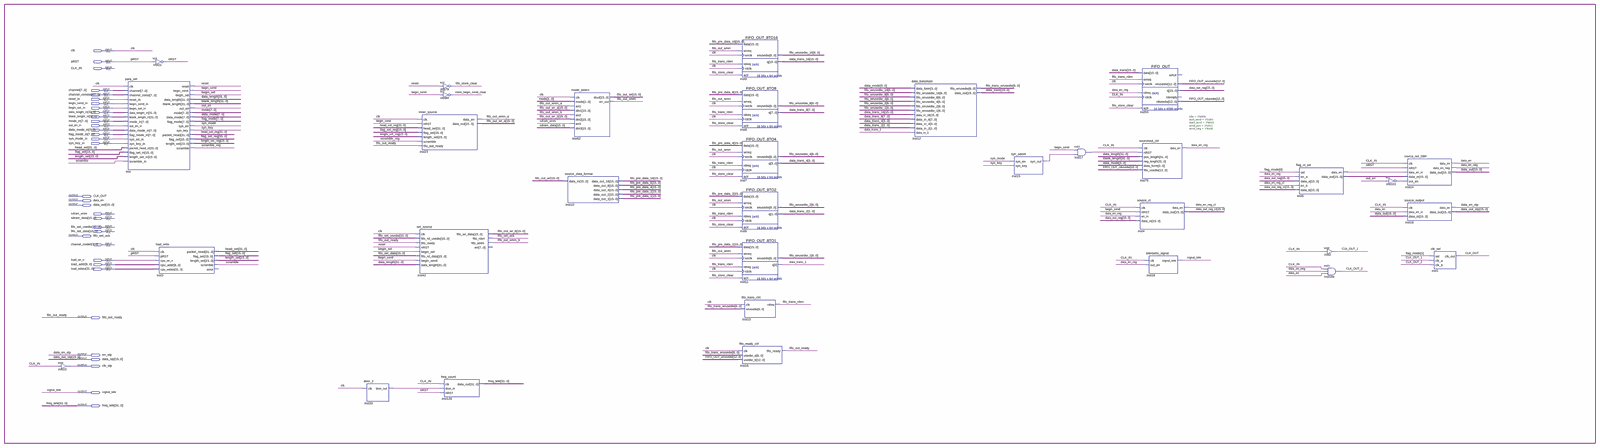
[diagram p0: schematic sheet, whole]
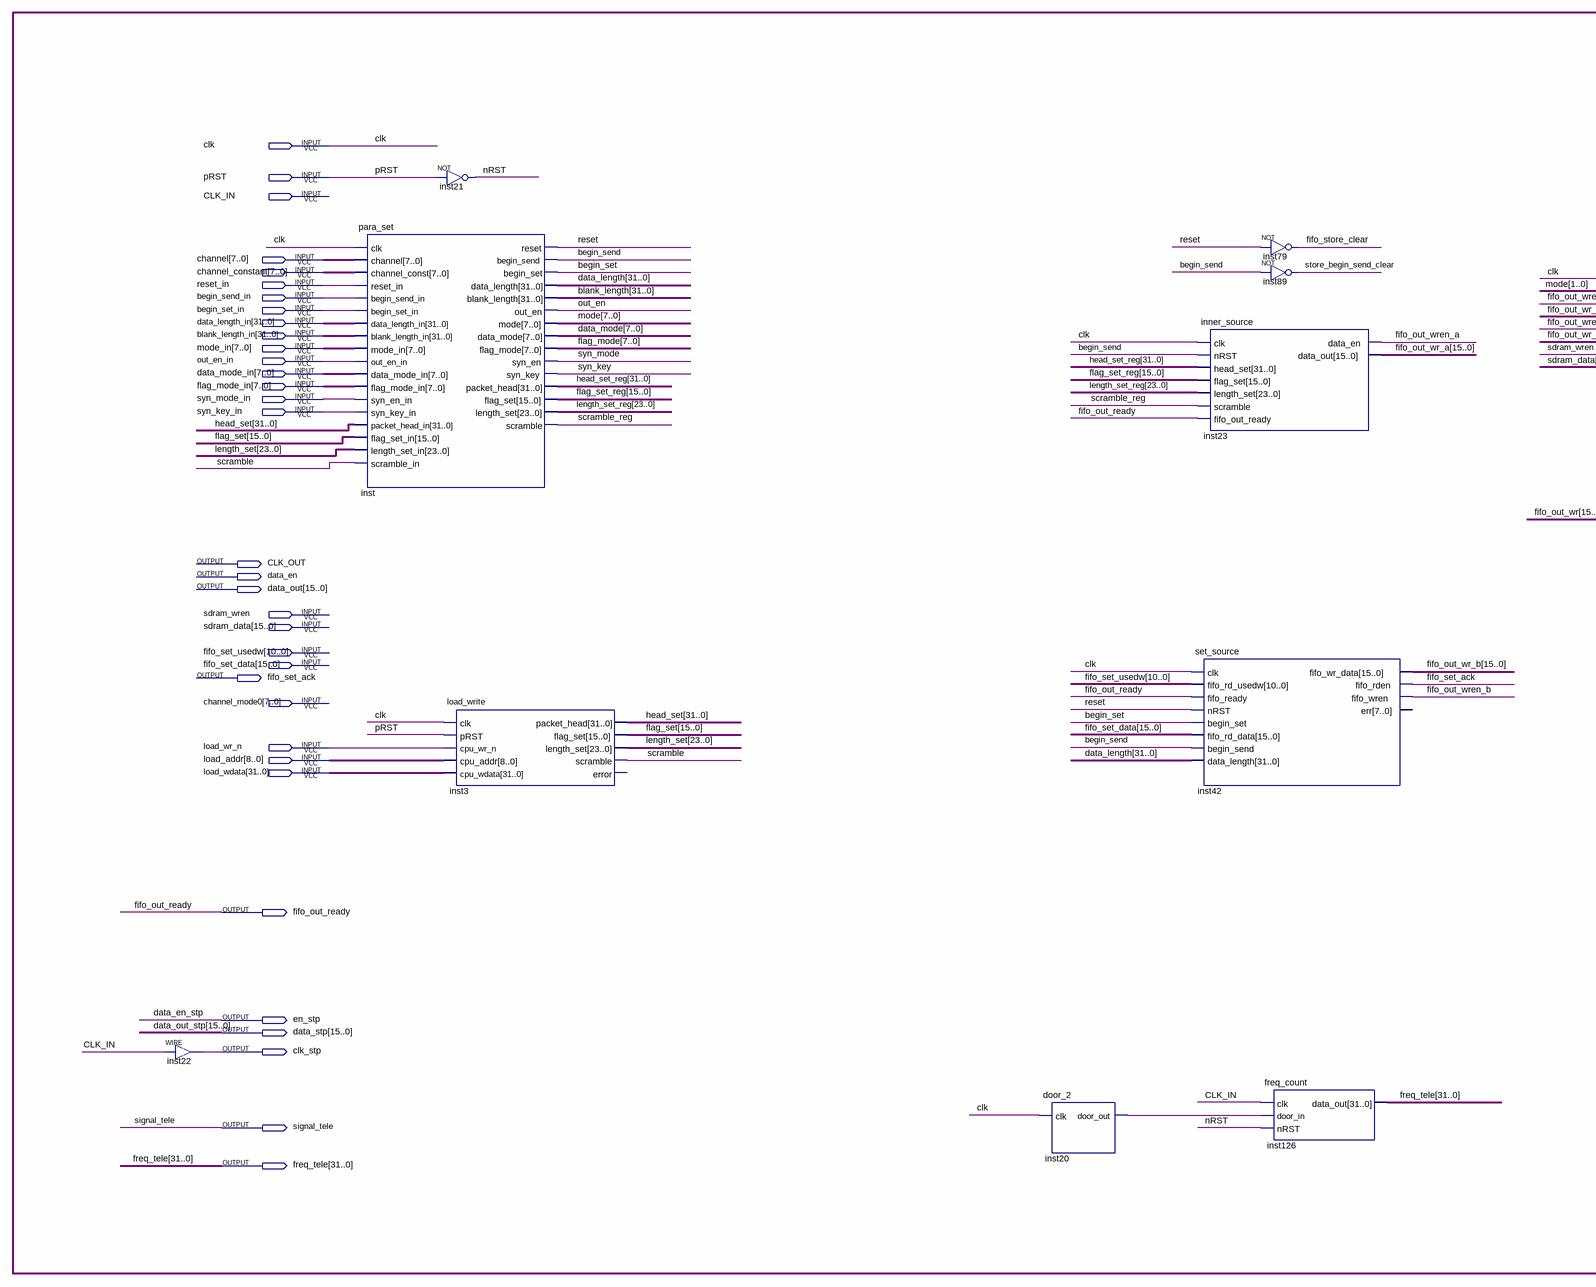
[diagram p1: schematic sheet, left part]
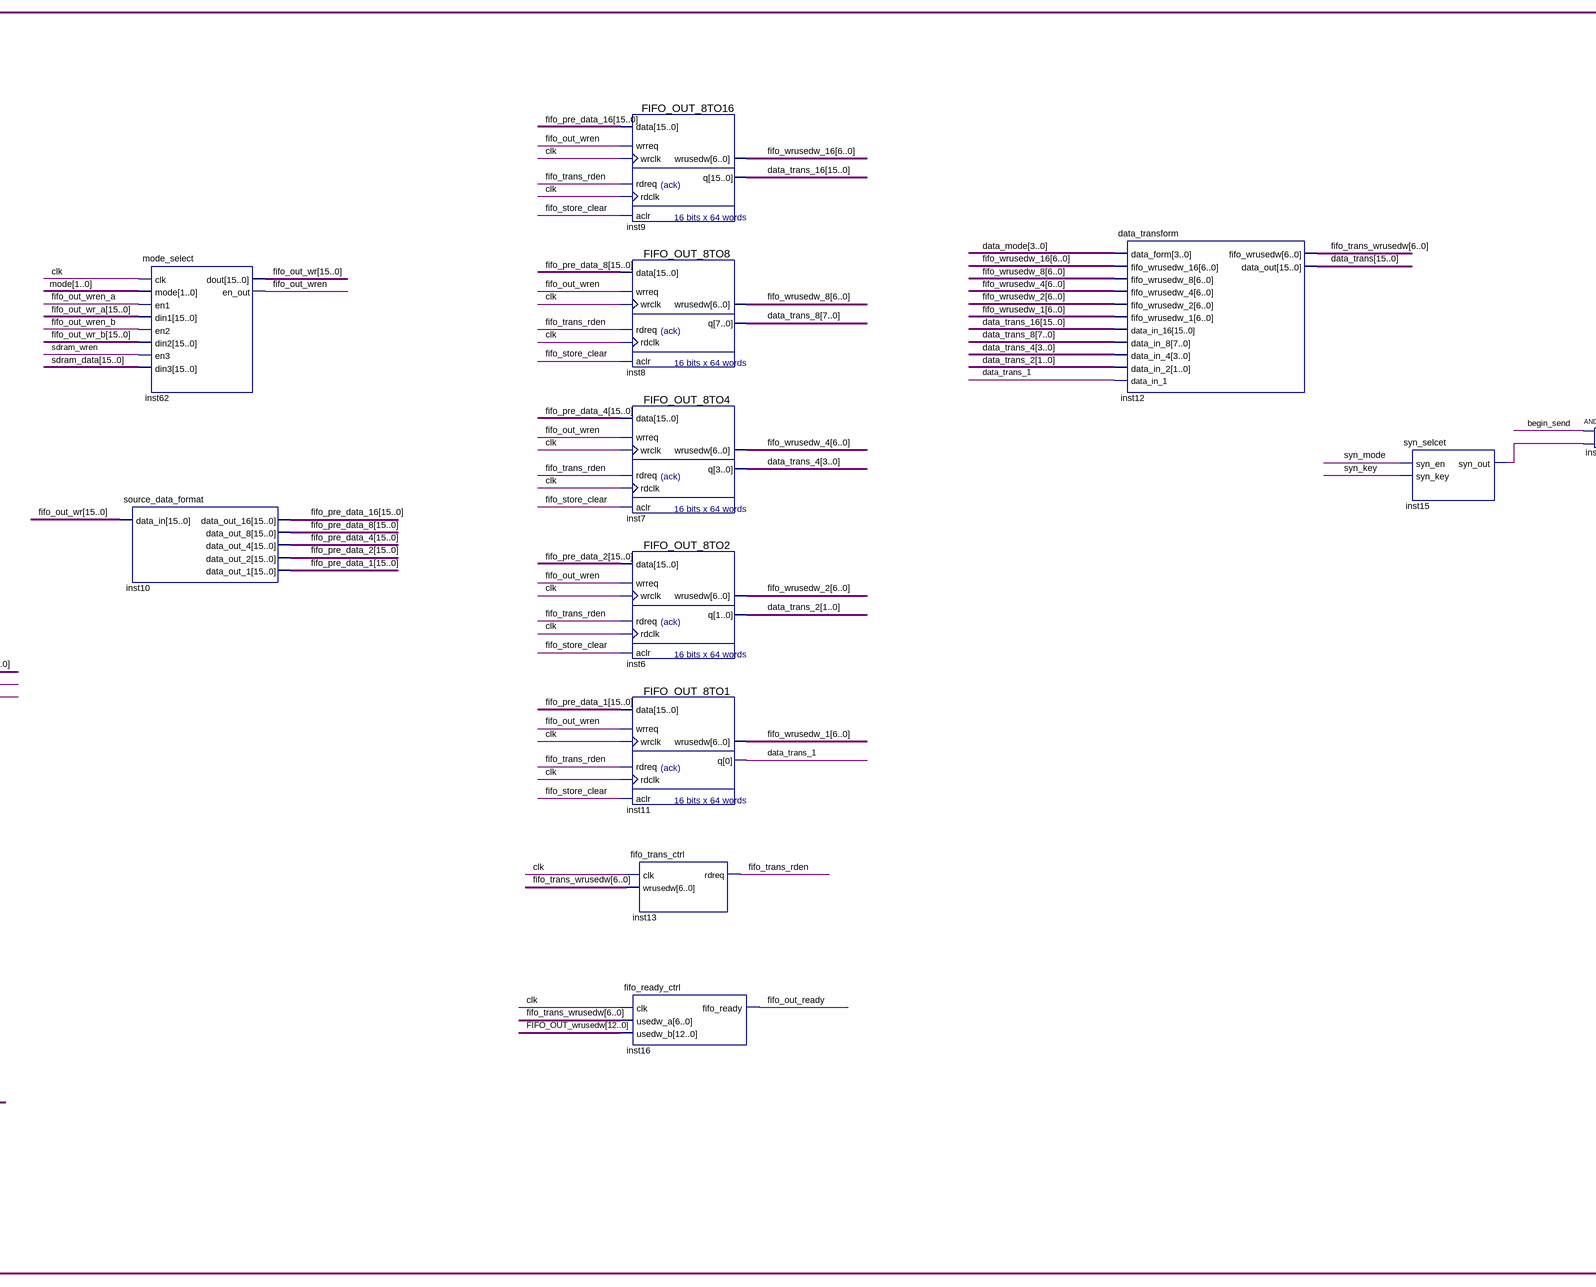
[diagram p2: schematic sheet, centre part]
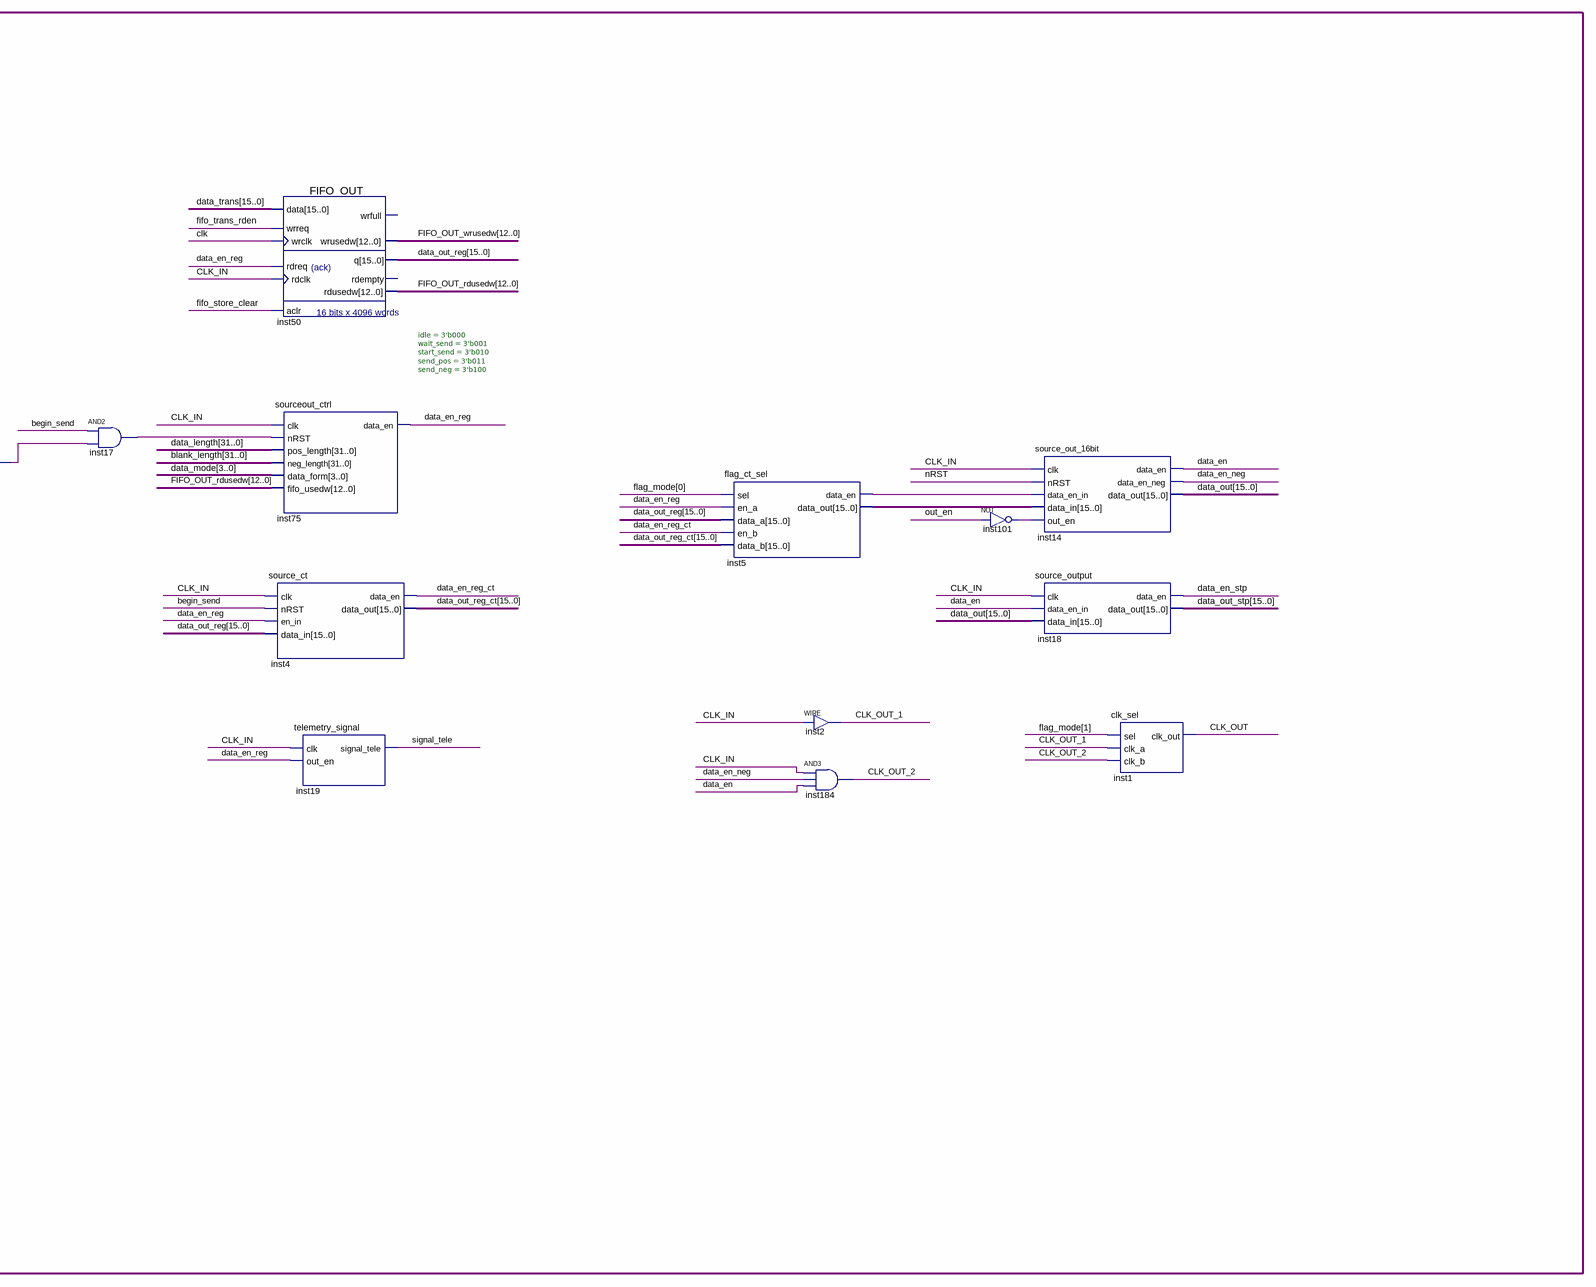
[diagram p3: schematic sheet, right part]
// Quartus schematic data_source_blk.bdf as structural Verilog: 33 symbols, 34 pins
module data_source_blk (
  input  clk,
  input  pRST,
  input  CLK_IN,
  input  [7:0] channel,
  input  [7:0] channel_constant,
  input  reset_in,
  input  begin_send_in,
  input  begin_set_in,
  input  [31:0] data_length_in,
  input  [31:0] blank_length_in,
  input  [7:0] mode_in,
  input  out_en_in,
  input  [7:0] data_mode_in,
  input  [7:0] flag_mode_in,
  input  syn_mode_in,
  input  syn_key_in,
  input  sdram_wren,
  input  [15:0] sdram_data,
  input  [10:0] fifo_set_usedw,
  input  [15:0] fifo_set_data,
  input  [7:0] channel_mode0,
  input  load_wr_n,
  input  [8:0] load_addr,
  input  [31:0] load_wdata,
  output CLK_OUT,
  output data_en,
  output [15:0] data_out,
  output fifo_set_ack,
  output fifo_out_ready,
  output en_stp,
  output [15:0] data_stp,
  output clk_stp,
  output signal_tele,
  output [31:0] freq_tele
);

  wire begin_send, begin_set, CLK_OUT_1, CLK_OUT_2, data_en_neg, data_en_reg, data_en_reg_ct, data_trans_1,
       fifo_out_wren, fifo_out_wren_a, fifo_out_wren_b, fifo_store_clear, fifo_trans_rden, inst5_data_en,
       inst15_syn_out, inst17_out, inst20_door_out, inst101_out, nRST, out_en, reset, scramble, scramble_reg,
       store_begin_send_clear, syn_key, syn_mode;
  wire [1:0] data_trans_2;
  wire [3:0] data_trans_4;
  wire [6:0] fifo_trans_wrusedw, fifo_wrusedw_1, fifo_wrusedw_2, fifo_wrusedw_4, fifo_wrusedw_8,
       fifo_wrusedw_16;
  wire [7:0] data_mode, data_trans_8, flag_mode, mode;
  wire [12:0] FIFO_OUT_rdusedw, FIFO_OUT_wrusedw;
  wire [15:0] data_out_reg, data_out_reg_ct, data_trans, data_trans_16, fifo_out_wr, fifo_out_wr_a,
       fifo_out_wr_b, fifo_pre_data_1, fifo_pre_data_2, fifo_pre_data_4, fifo_pre_data_8, fifo_pre_data_16,
       flag_set, flag_set_reg, inst5_data_out;
  wire [23:0] length_set, length_set_reg;
  wire [31:0] blank_length, data_length, head_set, head_set_reg;

  assign clk_stp = CLK_IN;  // WIRE inst22
  para_set inst (
    .clk(clk), .channel(channel), .channel_const(channel_constant), .reset_in(reset_in),
    .begin_send_in(begin_send_in), .begin_set_in(begin_set_in), .data_length_in(data_length_in),
    .blank_length_in(blank_length_in), .mode_in(mode_in), .out_en_in(out_en_in), .data_mode_in(data_mode_in),
    .flag_mode_in(flag_mode_in), .syn_en_in(syn_mode_in), .syn_key_in(syn_key_in), .packet_head_in(head_set),
    .flag_set_in(flag_set), .length_set_in(length_set), .scramble_in(scramble), .reset(reset),
    .begin_send(begin_send), .begin_set(begin_set), .data_length(data_length), .blank_length(blank_length),
    .out_en(out_en), .mode(mode), .data_mode(data_mode), .flag_mode(flag_mode), .syn_en(syn_mode),
    .syn_key(syn_key), .packet_head(head_set_reg), .flag_set(flag_set_reg), .length_set(length_set_reg),
    .scramble(scramble_reg));
  not inst21 (nRST, pRST);
  load_write inst3 (
    .clk(clk), .pRST(pRST), .cpu_wr_n(load_wr_n), .cpu_addr(load_addr), .cpu_wdata(load_wdata),
    .packet_head(head_set), .flag_set(flag_set), .length_set(length_set), .scramble(scramble));  // open: error
  door_2 inst20 (.clk(clk), .door_out(inst20_door_out));
  set_source inst42 (
    .clk(clk), .fifo_rd_usedw(fifo_set_usedw), .fifo_ready(fifo_out_ready), .nRST(reset),
    .begin_set(begin_set), .fifo_rd_data(fifo_set_data), .begin_send(begin_send), .data_length(data_length),
    .fifo_wr_data(fifo_out_wr_b), .fifo_rden(fifo_set_ack), .fifo_wren(fifo_out_wren_b));  // open: err
  inner_source inst23 (
    .clk(clk), .nRST(begin_send), .head_set(head_set_reg), .flag_set(flag_set_reg),
    .length_set(length_set_reg), .scramble(scramble_reg), .fifo_out_ready(fifo_out_ready),
    .data_en(fifo_out_wren_a), .data_out(fifo_out_wr_a));
  not inst79 (fifo_store_clear, reset);
  not inst89 (store_begin_send_clear, begin_send);
  freq_count inst126 (.clk(CLK_IN), .door_in(inst20_door_out), .nRST(nRST), .data_out(freq_tele));
  mode_select inst62 (
    .clk(clk), .mode(mode[1:0]), .en1(fifo_out_wren_a), .din1(fifo_out_wr_a), .en2(fifo_out_wren_b),
    .din2(fifo_out_wr_b), .en3(sdram_wren), .din3(sdram_data), .dout(fifo_out_wr), .en_out(fifo_out_wren));
  source_data_format inst10 (
    .data_in(fifo_out_wr), .data_out_16(fifo_pre_data_16), .data_out_8(fifo_pre_data_8),
    .data_out_4(fifo_pre_data_4), .data_out_2(fifo_pre_data_2), .data_out_1(fifo_pre_data_1));
  FIFO_OUT_8TO16 inst9 (
    .data(fifo_pre_data_16), .wrreq(fifo_out_wren), .wrclk(clk), .rdreq(fifo_trans_rden), .rdclk(clk),
    .aclr(fifo_store_clear), .wrusedw(fifo_wrusedw_16), .q(data_trans_16));
  FIFO_OUT_8TO8 inst8 (
    .data(fifo_pre_data_8), .wrreq(fifo_out_wren), .wrclk(clk), .rdreq(fifo_trans_rden), .rdclk(clk),
    .aclr(fifo_store_clear), .wrusedw(fifo_wrusedw_8), .q(data_trans_8));
  FIFO_OUT_8TO4 inst7 (
    .data(fifo_pre_data_4), .wrreq(fifo_out_wren), .wrclk(clk), .rdreq(fifo_trans_rden), .rdclk(clk),
    .aclr(fifo_store_clear), .wrusedw(fifo_wrusedw_4), .q(data_trans_4));
  FIFO_OUT_8TO2 inst6 (
    .data(fifo_pre_data_2), .wrreq(fifo_out_wren), .wrclk(clk), .rdreq(fifo_trans_rden), .rdclk(clk),
    .aclr(fifo_store_clear), .wrusedw(fifo_wrusedw_2), .q(data_trans_2));
  FIFO_OUT_8TO1 inst11 (
    .data(fifo_pre_data_1), .wrreq(fifo_out_wren), .wrclk(clk), .rdreq(fifo_trans_rden), .rdclk(clk),
    .aclr(fifo_store_clear), .wrusedw(fifo_wrusedw_1), .q(data_trans_1));
  fifo_trans_ctrl inst13 (.clk(clk), .wrusedw(fifo_trans_wrusedw), .rdreq(fifo_trans_rden));
  fifo_ready_ctrl inst16 (
    .clk(clk), .usedw_a(fifo_trans_wrusedw), .usedw_b(FIFO_OUT_wrusedw), .fifo_ready(fifo_out_ready));
  data_transform inst12 (
    .data_form(data_mode[3:0]), .fifo_wrusedw_16(fifo_wrusedw_16), .fifo_wrusedw_8(fifo_wrusedw_8),
    .fifo_wrusedw_4(fifo_wrusedw_4), .fifo_wrusedw_2(fifo_wrusedw_2), .fifo_wrusedw_1(fifo_wrusedw_1),
    .data_in_16(data_trans_16), .data_in_8(data_trans_8), .data_in_4(data_trans_4), .data_in_2(data_trans_2),
    .data_in_1(data_trans_1), .fifo_wrusedw(fifo_trans_wrusedw), .data_out(data_trans));
  syn_selcet inst15 (.syn_en(syn_mode), .syn_key(syn_key), .syn_out(inst15_syn_out));
  and inst17 (inst17_out, begin_send, inst15_syn_out);
  FIFO_OUT inst50 (
    .data(data_trans), .wrreq(fifo_trans_rden), .wrclk(clk), .rdreq(data_en_reg), .rdclk(CLK_IN),
    .aclr(fifo_store_clear), .wrusedw(FIFO_OUT_wrusedw), .q(data_out_reg), .rdusedw(FIFO_OUT_rdusedw));  // open: wrfull, rdempty
  sourceout_ctrl #(.idle(3'b000), .wait_send(3'b001), .start_send(3'b010), .send_pos(3'b011), .send_neg(3'b100)) inst75 (
    .clk(CLK_IN), .nRST(inst17_out), .pos_length(data_length), .neg_length(blank_length),
    .data_form(data_mode[3:0]), .fifo_usedw(FIFO_OUT_rdusedw), .data_en(data_en_reg));
  source_ct inst4 (
    .clk(CLK_IN), .nRST(begin_send), .en_in(data_en_reg), .data_in(data_out_reg), .data_en(data_en_reg_ct),
    .data_out(data_out_reg_ct));
  telemetry_signal inst19 (.clk(CLK_IN), .out_en(data_en_reg), .signal_tele(signal_tele));
  flag_ct_sel inst5 (
    .sel(flag_mode[0]), .en_a(data_en_reg), .data_a(data_out_reg), .en_b(data_en_reg_ct),
    .data_b(data_out_reg_ct), .data_en(inst5_data_en), .data_out(inst5_data_out));
  assign CLK_OUT_1 = CLK_IN;  // WIRE inst2
  and inst184 (CLK_OUT_2, CLK_IN, data_en_neg, data_en);
  not inst101 (inst101_out, out_en);
  source_out_16bit inst14 (
    .clk(CLK_IN), .nRST(nRST), .data_en_in(inst5_data_en), .data_in(inst5_data_out), .out_en(inst101_out),
    .data_en(data_en), .data_en_neg(data_en_neg), .data_out(data_out));
  source_output inst18 (.clk(CLK_IN), .data_en_in(data_en), .data_in(data_out), .data_en(en_stp), .data_out(data_stp));
  clk_sel inst1 (.sel(flag_mode[1]), .clk_a(CLK_OUT_1), .clk_b(CLK_OUT_2), .clk_out(CLK_OUT));

  // Other names for the same wires on the sheet: data_en_stp = en_stp; data_out_stp[15:0] = data_stp
endmodule
